# EAGLE design de0_nano_expansion_board (EAGLE 5.11)
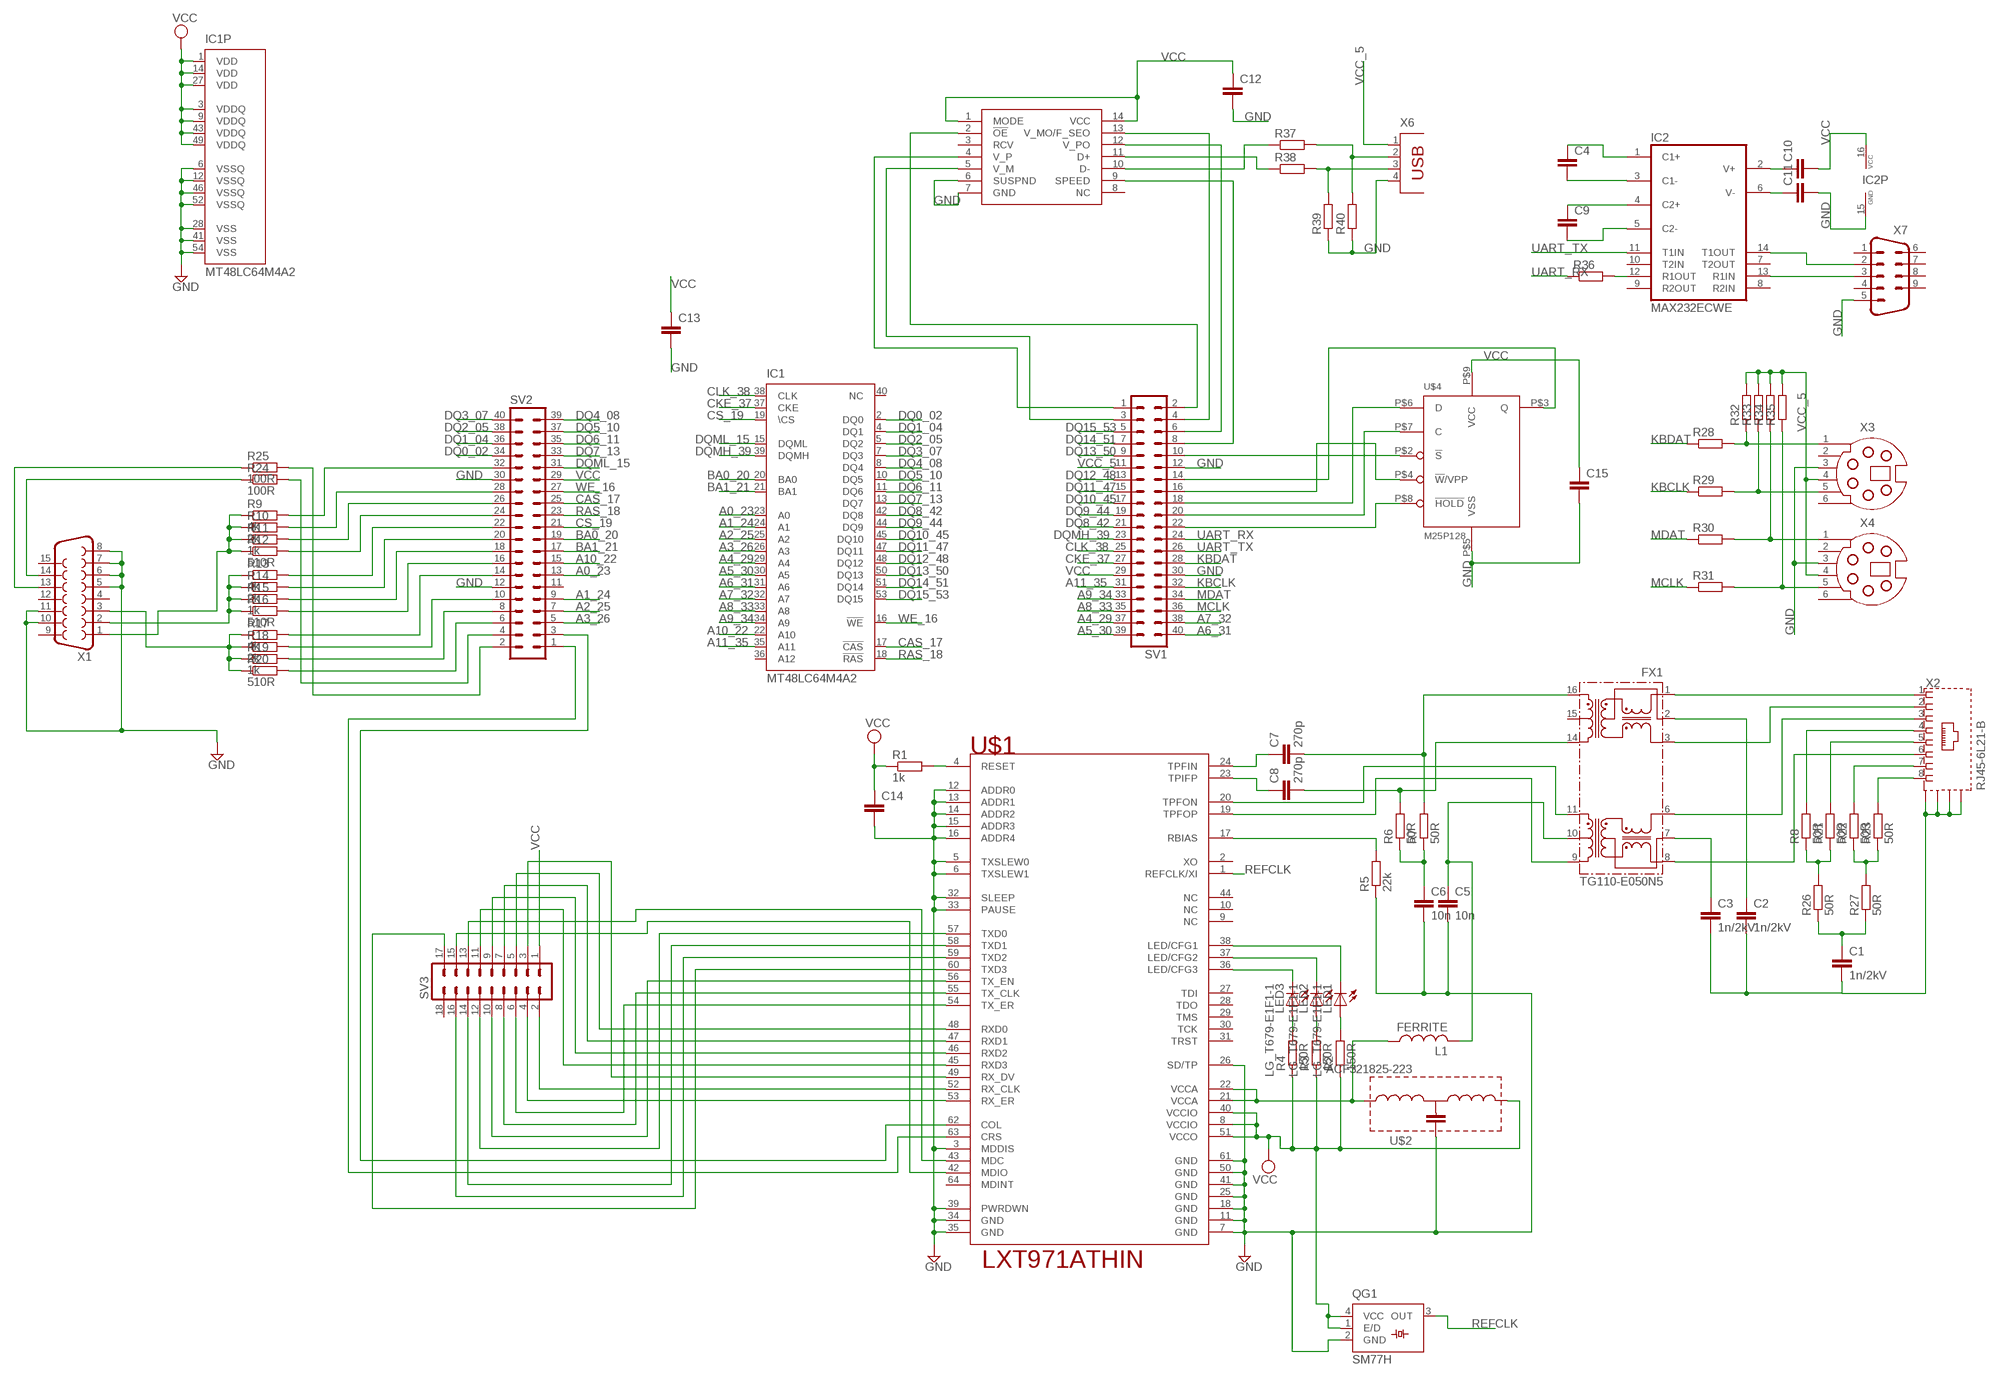
[diagram p0: schematic, sheet 1]

## Parts
C1  1n/2kV  C-EUC1812  [C1812]
C2  1n/2kV  C-EUC1812  [C1812]
C3  1n/2kV  C-EUC1812  [C1812]
C4  C-EUC0805  [C0805]
C5  10n  C-EUC0805  [C0805]
C6  10n  C-EUC0805  [C0805]
C7  270p  C-EUC0805  [C0805]
C8  270p  C-EUC0805  [C0805]
C9  C-EUC0805  [C0805]
C10  C-EUC0805  [C0805]
C11  C-EUC0805  [C0805]
C12  C-EUC0805  [C0805]
C13  C-EUC0805  [C0805]
C14  C-EUC0805  [C0805]
C15  C-EUC0805  [C0805]
FX1  TG110-E050N5  [N5]
IC1  MT48LC64M4A2  [TSOP54-400]
IC2  MAX232ECWE  [SO16L]
L1  FERRITE  L-USL4532C  [L4532M]
LED1  LG_T679-E1F1-1  [PLCC2]
LED2  LG_T679-E1F1-1  [PLCC2]
LED3  LG_T679-E1F1-1  [PLCC2]
QG1  SM77H  [SM77H]
R1  1k  R-EU_R0805  [R0805]
R2  150R  R-EU_R0805  [R0805]
R3  150R  R-EU_R0805  [R0805]
R4  150R  R-EU_R0805  [R0805]
R5  22k  R-EU_R0805  [R0805]
R6  50R  R-EU_R0805  [R0805]
R7  50R  R-EU_R0805  [R0805]
R8  50R  R-EU_R0805  [R0805]
R9  4k  R-EU_M0805  [M0805]
R10  2k  R-EU_M0805  [M0805]
R11  1k  R-EU_M0805  [M0805]
R12  510R  R-EU_M0805  [M0805]
R13  4k  R-EU_M0805  [M0805]
R14  2k  R-EU_M0805  [M0805]
R15  1k  R-EU_M0805  [M0805]
R16  510R  R-EU_M0805  [M0805]
R17  4k  R-EU_M0805  [M0805]
R18  2k  R-EU_M0805  [M0805]
R19  1k  R-EU_M0805  [M0805]
R20  510R  R-EU_M0805  [M0805]
R21  50R  R-EU_R0805  [R0805]
R22  50R  R-EU_R0805  [R0805]
R23  50R  R-EU_R0805  [R0805]
R24  100R  R-EU_M0805  [M0805]
R25  100R  R-EU_M0805  [M0805]
R26  50R  R-EU_R0805  [R0805]
R27  50R  R-EU_R0805  [R0805]
R28  R-EU_R0805  [R0805]
R29  R-EU_R0805  [R0805]
R30  R-EU_R0805  [R0805]
R31  R-EU_R0805  [R0805]
R32  R-EU_R0805  [R0805]
R33  R-EU_R0805  [R0805]
R34  R-EU_R0805  [R0805]
R35  R-EU_R0805  [R0805]
R36  R-EU_R0805  [R0805]
R37  R-EU_R0805  [R0805]
R38  R-EU_R0805  [R0805]
R39  R-EU_R0805  [R0805]
R40  R-EU_R0805  [R0805]
SV1  MA20-2  [MA20-2]
SV2  MA20-2  [MA20-2]
SV3  MA09-2  [MA09-2]
U$1  LXT971ATHIN  [LQFP64_THIN]
U$2  ACF321825-223  [FILT-223]
U$4  M25P128  [VDFPN-8]
U$5  USB1T11A  [TSSOP14]
X1  F15HDH  [HDF15H]
X2  RJ45-6L21-B  [RJ45-SHIELD1]
X3  MDSSV-BC06  [SSV-BC06]
X4  MDSSV-BC06  [SSV-BC06]
X6  PN87520  [PN87520]
X7  M09HP  [M09HP]

## Nets
A0_23 [thin]: IC1.23(A0) SV2.13
A1_24 [thin]: IC1.24(A1) SV2.9
A2_25 [thin]: IC1.25(A2) SV2.7
A3_26 [thin]: IC1.26(A3) SV2.5
A4_29 [thin]: IC1.29(A4) SV1.37
A5_30 [thin]: IC1.30(A5) SV1.39
A6_31 [thin]: IC1.31(A6) SV1.40
A7_32 [thin]: IC1.32(A7) SV1.38
A8_33 [thin]: IC1.33(A8) SV1.35
A9_34 [thin]: IC1.34(A9) SV1.33
A10_22 [thin]: IC1.22(A10) SV2.15
A11_35 [thin]: IC1.35(A11) SV1.31
BA0_20 [thin]: IC1.20(BA0) SV2.19
BA1_21 [thin]: IC1.21(BA1) SV2.17
CAS_17 [thin]: IC1.17(!CAS) SV2.25
CKE_37 [thin]: IC1.37(CKE) SV1.27
CLK_38 [thin]: IC1.38(CLK) SV1.25
CS_19 [thin]: IC1.19(\CS) SV2.21
DQ0_02 [thin]: IC1.2(DQ0) SV2.34
DQ1_04 [thin]: IC1.4(DQ1) SV2.36
DQ2_05 [thin]: IC1.5(DQ2) SV2.38
DQ3_07 [thin]: IC1.7(DQ3) SV2.40
DQ4_08 [thin]: IC1.8(DQ4) SV2.39
DQ5_10 [thin]: IC1.10(DQ5) SV2.37
DQ6_11 [thin]: IC1.11(DQ6) SV2.35
DQ7_13 [thin]: IC1.13(DQ7) SV2.33
DQ8_42 [thin]: IC1.42(DQ8) SV1.21
DQ9_44 [thin]: IC1.44(DQ9) SV1.19
DQ10_45 [thin]: IC1.45(DQ10) SV1.17
DQ11_47 [thin]: IC1.47(DQ11) SV1.15
DQ12_48 [thin]: IC1.48(DQ12) SV1.13
DQ13_50 [thin]: IC1.50(DQ13) SV1.9
DQ14_51 [thin]: IC1.51(DQ14) SV1.7
DQ15_53 [thin]: IC1.53(DQ15) SV1.5
DQMH_39 [thin]: IC1.39(DQMH) SV1.23
DQML_15 [thin]: IC1.15(DQML) SV2.31
GND [power]: C5.2 C6.2 C11.2 C12.2 C13.2 C14.2 C15.2 IC1.6(VSSQ) IC1.12(VSSQ) IC1.28(VSS) IC1.41(VSS) IC1.46(VSSQ) IC1.52(VSSQ) IC1.54(VSS) IC2.15(GND) QG1.2(GND) R5.1 R39.1 R40.1 SV1.12 SV1.30 SV2.12 SV2.30 U$1.3(MDDIS) U$1.5(TXSLEW0) U$1.6(TXSLEW1) U$1.7(GND) U$1.11(GND) U$1.12(ADDR0) U$1.13(ADDR1) U$1.14(ADDR2) U$1.15(ADDR3) U$1.16(ADDR4) U$1.18(GND) U$1.25(GND) U$1.26(SD/TP) U$1.32(SLEEP) U$1.33(PAUSE) U$1.34(GND) U$1.35(GND) U$1.39(PWRDWN) U$1.41(GND) U$1.50(GND) U$1.61(GND) U$2.P$2 U$4.P$5(VSS) U$5.6(SUSPND) U$5.7(GND) X1.5 X1.6 X1.7 X1.8 X1.10 X1.11 X3.3 X4.3 X6.4 X7.5
KBCLK: R29.1 SV1.32
KBDAT: R28.1 SV1.28
MCLK: R31.1 SV1.36
MDAT: R30.1 SV1.34
N$1: FX1.1 X2.1
N$2: C3.1 FX1.7
N$3 [thin]: R1.2 U$1.4(RESET)
N$4: LED3.A R4.2
N$5 [thin]: SV3.6 U$1.54(TX_ER)
N$6 [thin]: SV3.11 U$1.45(RXD3)
N$7: R13.1 R14.1 R15.1 R16.1 X1.2
N$8: R17.1 R18.1 R19.1 R20.1 X1.3
N$9: R9.1 R10.1 R11.1 R12.1 X1.1
N$10 [thin]: SV2.3 U$1.62(COL)
N$11 [thin]: SV2.1 U$1.63(CRS)
N$12 [thin]: SV3.8 U$1.55(TX_CLK)
N$13 [thin]: SV3.10 U$1.56(TX_EN)
N$14 [thin]: SV3.9 U$1.46(RXD2)
N$15 [thin]: FX1.9 U$1.19(TPFOP)
N$16: R25.1 X1.13
N$17 [thin]: SV3.7 U$1.47(RXD1)
N$18: R24.1 X1.14
N$19: R20.2 SV2.6
N$20: L1.1 U$1.21(VCCA) U$1.22(VCCA) U$2.P$1
N$21 [thin]: LED3.C U$1.36(LED/CFG3)
N$22 [thin]: LED2.C U$1.37(LED/CFG2)
N$23 [thin]: LED1.C U$1.38(LED/CFG1)
N$24 [thin]: SV3.5 U$1.48(RXD0)
N$25: LED2.A R3.2
N$26: LED1.A R2.2
N$27: C2.1 FX1.2
N$28: FX1.3 X2.2
N$29: FX1.6 X2.3
N$30: C5.1 FX1.10 L1.2
N$31 [thin]: C7.1 U$1.24(TPFIN)
N$32 [thin]: C8.1 U$1.23(TPIFP)
N$33 [thin]: R5.2 U$1.17(RBIAS)
N$34: C7.2 FX1.16 R7.2
N$35: C8.2 FX1.14 R6.2
N$36: C6.1 R6.1 R7.1
N$37 [thin]: FX1.11 U$1.20(TPFON)
N$38: FX1.8 X2.6
N$39: R19.2 SV2.8
N$40: R18.2 SV2.10
N$41: R17.2 SV2.14
N$42: R16.2 SV2.16
N$43: R15.2 SV2.18
N$44: R14.2 SV2.20
N$45: R13.2 SV2.22
N$46: R12.2 SV2.24
N$47: R11.2 SV2.26
N$48: R10.2 SV2.28
N$49: R9.2 SV2.32
N$50: R24.2 SV2.4
N$51: R25.2 SV2.2
N$52 [thin]: SV3.3 U$1.49(RX_DV)
N$53 [thin]: SV3.2 U$1.52(RX_CLK)
N$54 [thin]: SV3.4 U$1.53(RX_ER)
N$55 [thin]: SV3.13 U$1.43(MDC)
N$56 [thin]: SV3.15 U$1.42(MDIO)
N$57 [thin]: SV3.12 U$1.57(TXD0)
N$58 [thin]: SV3.14 U$1.58(TXD1)
N$59 [thin]: SV3.16 U$1.59(TXD2)
N$60 [thin]: SV3.17 U$1.60(TXD3)
N$61: R8.2 X2.4
N$62: R21.2 X2.5
N$63: R22.2 X2.7
N$64: R23.2 X2.8
N$65: R8.1 R21.1 R26.2
N$66: R28.2 R32.1 X3.1
N$67: R22.1 R23.1 R27.2
N$68: R29.2 R33.1 X3.5
N$69: C1.1 R26.1 R27.1
N$70: C1.2 C2.2 C3.2 X2.S1(S) X2.S2(S) X2.S3(S) X2.S4(S)
N$71: R30.2 R34.1 X4.1
N$72: R31.2 R35.1 X4.5
N$73: IC2.12(R1OUT) R36.2
N$74: C4.1 IC2.1(C1+)
N$75: C4.2 IC2.3(C1-)
N$76: C9.1 IC2.4(C2+)
N$77: C9.2 IC2.5(C2-)
N$78: C10.1 IC2.2(V+)
N$79: C11.1 IC2.6(V-)
N$80: IC2.14(T1OUT) X7.2
N$81: IC2.13(R1IN) X7.3
N$82: SV1.22 U$4.P$8(!HOLD)
N$83: SV1.20 U$4.P$7(C)
N$84: SV1.18 U$4.P$6(D)
N$85: SV1.10 U$4.P$2(!S)
N$86: SV1.16 U$4.P$4(!W!/VPP)
N$87: SV1.14 U$4.P$3(Q)
N$88: R37.2 R40.2 X6.2
N$89: R38.2 R39.2 X6.3
N$90 [thin]: R37.1 U$5.10(D-)
N$91 [thin]: R38.1 U$5.11(D+)
N$92 [thin]: SV1.1 U$5.4(V_P)
N$93 [thin]: SV1.3 U$5.5(V_M)
N$94 [thin]: SV1.2 U$5.2(!OE)
N$95 [thin]: SV1.4 U$5.13(V_MO/F_SEO)
N$96 [thin]: SV1.6 U$5.12(V_PO)
N$97 [thin]: SV1.8 U$5.9(SPEED)
RAS_18 [thin]: IC1.18(!RAS) SV2.23
REFCLK [thin]: QG1.3(OUT) U$1.1(REFCLK/XI)
UART_RX: R36.1 SV1.24
UART_TX: IC2.11(T1IN) SV1.26
VCC [thin]: C10.2 C12.1 C13.1 C14.1 C15.1 IC1.1(VDD) IC1.3(VDDQ) IC1.9(VDDQ) IC1.14(VDD) IC1.27(VDD) IC1.43(VDDQ) IC1.49(VDDQ) IC2.16(VCC) QG1.1(E/D) QG1.4(VCC) R1.1 R2.1 R3.1 R4.1 SV1.29 SV2.29 SV3.1 U$1.8(VCCIO) U$1.40(VCCIO) U$1.51(VCCO) U$2.P$3 U$4.P$9(VCC) U$5.1(MODE) U$5.14(VCC)
VCC_5: R32.2 R33.2 R34.2 R35.2 SV1.11 X3.4 X4.4 X6.1
WE_16 [thin]: IC1.16(!WE) SV2.27
Unconnected: FX1.15 IC1.36(A12) IC1.40(NC) IC2.7(T2OUT) IC2.8(R2IN) IC2.9(R2OUT) IC2.10(T2IN) SV2.11 SV3.18 U$1.2(XO) U$1.9(NC) U$1.10(NC) U$1.27(TDI) U$1.28(TDO) U$1.29(TMS) U$1.30(TCK) U$1.31(TRST) U$1.44(NC) U$1.64(MDINT) U$5.3(RCV) U$5.8(NC) X1.4 X1.9 X1.12 X1.15 X3.2 X3.6 X4.2 X4.6 X7.1 X7.4 X7.6 X7.7 X7.8 X7.9

## Library data of the parts
C1-C15 = rcl:C-EU: CAPACITOR, European symbol
FX1 = halo-electronics:TG110-E050N5: E-Ultra (TM) 10/100BASE-TX SOIC-16 Fast Ethernet Magnetic Modules Source: www.haloelectronics.com .. e-ultra.pdf
IC1 = memory-micron:MT48LC64M4A2: 256Mb: x16 SDRAM MT48LC64M4A2 - 16 Meg x 4 x 4 banks Source: http://download.micron.com/pdf/datasheets/dram/sdram/256MSDRAM.pdf; OC_FARNELL: unknown; OC_NEWARK: unknown
IC2 = maxim:MAX232ECWE: RS232 TRANSEIVER; MF: MAXIM; MPN: MAX232ECWE+; OC_FARNELL: 9724435; OC_NEWARK: 67K4440
L1 = rcl:L-US: INDUCTOR, American symbol
LED1-LED3 = led:*_T679-?-1: LC TOPLED® Low Current LED Source: http://catalog.osram-os.com .. LG_LS_LY_T679_OBS.pdf; COLOR: green
QG1 = crystal:SM77H: 3.3V CMOS Clock Oscillator Source: www.pletronics.com .. sm77h%203.3v.pdf; OC_FARNELL: unknown; OC_NEWARK: unknown
R1-R40 = rcl:R-EU_: RESISTOR, European symbol
SV1 SV2 = con-lstb:MA20-2: PIN HEADER; OC_FARNELL: unknown; OC_NEWARK: unknown
SV3 = con-lstb:MA09-2: PIN HEADER; OC_FARNELL: unknown; OC_NEWARK: unknown
U$1 = my_parts:LXT971A
U$2 = my_parts:ACF321825-223
U$4 = m25p128:M25P128: M25P128 128-Mbit, low-voltage, serial flash memory with 54-MHz SPI bus interface
U$5 = my_parts:USB1T11A
X1 = con-subd:F15: SUB-D; OC_FARNELL: unknown; OC_NEWARK: unknown
X2 = con-tycoelectronics:RJ45*2: RJ45 Low Profile Shield Type 2 For all RJ45 L, LC, LCT and X Series Models Source: www.tycoelectronics.com .. ENG_DS_1654001_1099_RJ_L_0507.pdf; OC_FARNELL: unknown; OC_NEWARK: unknown
X3 X4 = con-yamaichi:MDSSV-BC06: YAMAICHI CONNECTOR; OC_FARNELL: unknown; OC_NEWARK: unknown
X6 = con-berg:PN87520: BERG USB connector; OC_FARNELL: unknown; OC_NEWARK: unknown
X7 = con-subd:M09: SUB-D; OC_FARNELL: unknown; OC_NEWARK: unknown

## Net classes
0 default: width 0.45 mm, drill 0.381 mm, clearance 1.016 mm
1 power: width 0.889 mm, drill 0.61 mm, clearance 0.762 mm
2 thin: width 0.2 mm, drill 0.61 mm, clearance 0.508 mm

## Board
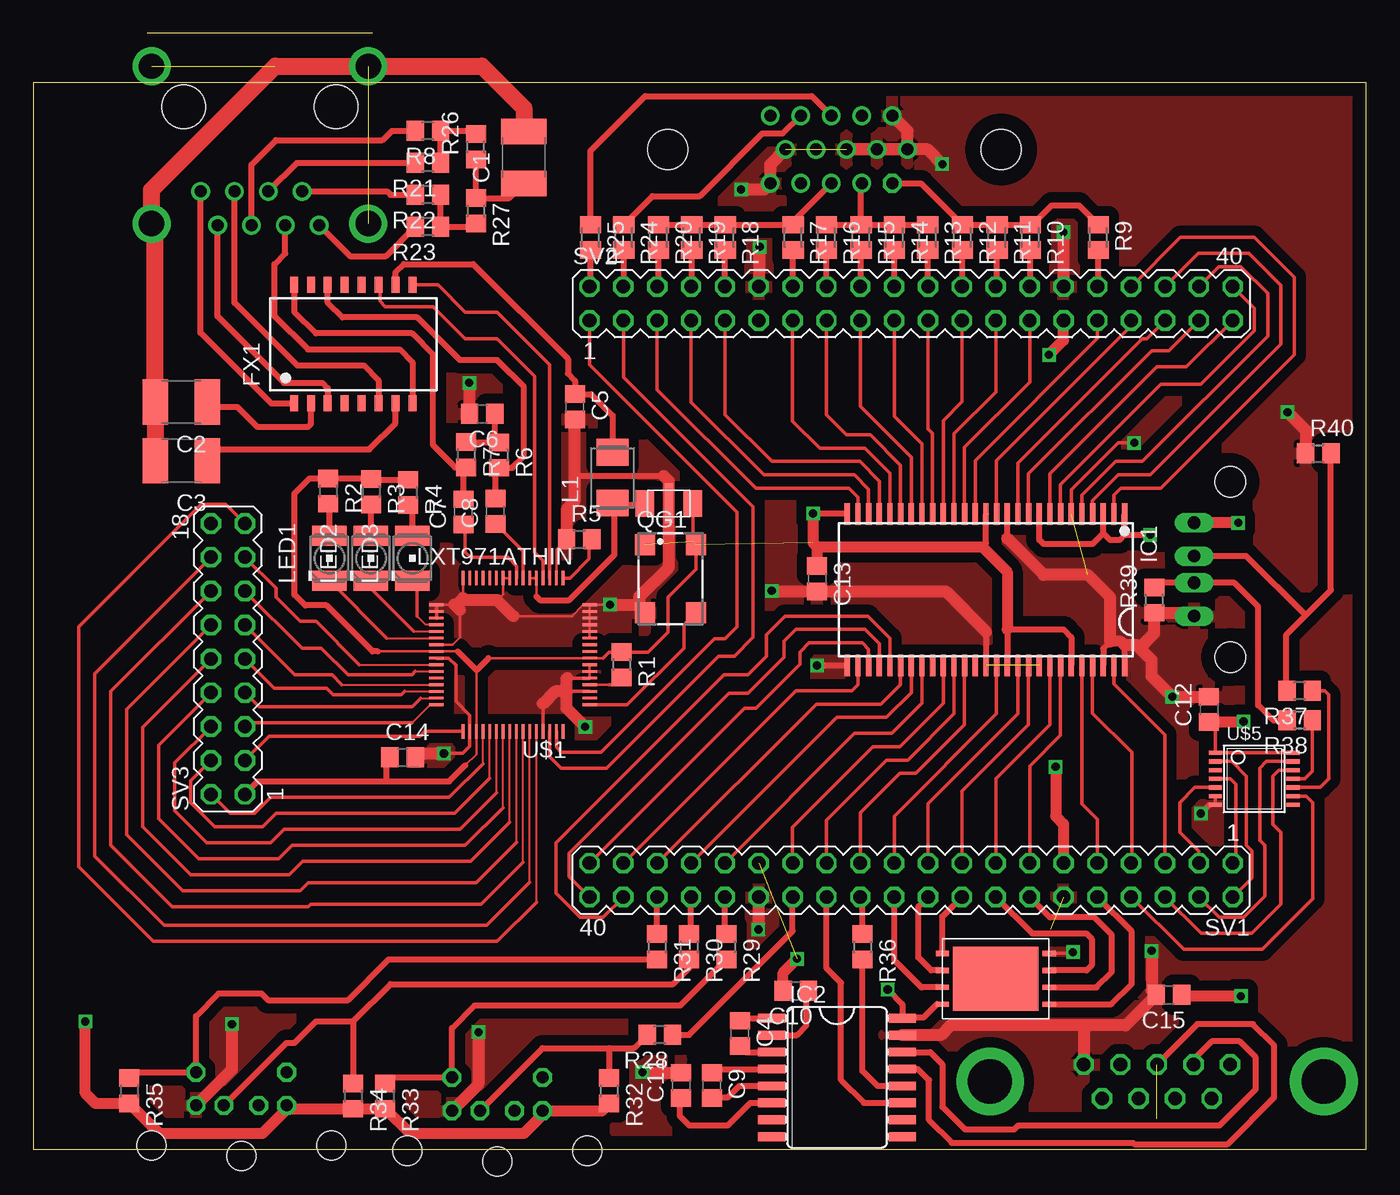
[diagram p1: board, top side]
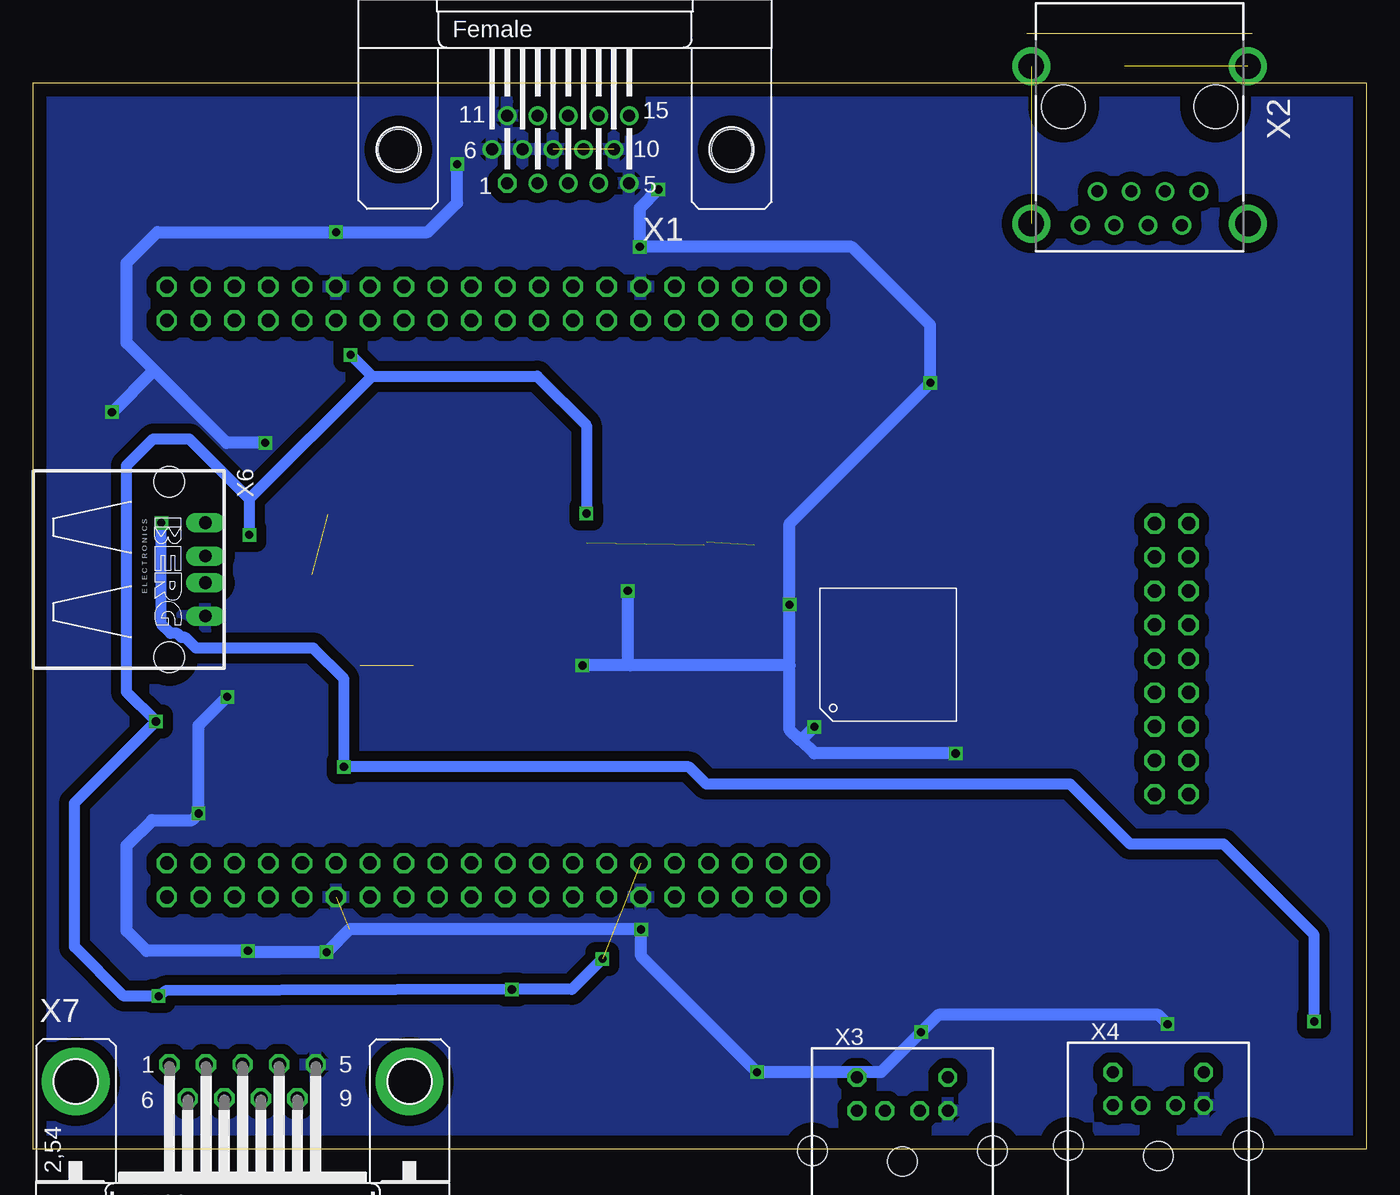
[diagram p2: board, bottom side, seen from below]

Size 100 x 80 mm. Coordinates in mm from the lower left corner, seen from the top.
Outline: 0,0 100,0 100,80 0,80 0,0
Copper layers (1*16): Top 0.035mm / dielectric 1.5mm / Bottom 0.035mm
Design rules "default": minimum track width 10mil, minimum drill 24mil, track to track 8mil, track to pad 8mil, pad to pad 8mil, via to via 8mil, smd to smd 8mil, copper to edge 40mil, drill to drill 8mil, minimum pad ring 10mil, minimum via ring 8mil, stop-mask expansion 4mil, vias tented up to drill 0mil, thermal gap 10mil

### Footprints (pad centres in the part's own frame; a part is rotated, then mirrored left to right if it is on the bottom)
C1812 = smd 1.9 x 3.4: 1 -1.95,0; 2 1.95,0
C0805 = smd 1.3 x 1.5: 1 -0.95,0; 2 0.95,0
N5 = smd 0.6 x 1.2: 1 -4.445,-4.445; 2 -3.175,-4.445; 3 -1.905,-4.445; 4 -0.635,-4.445; 5 0.635,-4.445; 6 1.905,-4.445; 7 3.175,-4.445; 8 4.445,-4.445; 9 4.445,4.445; 10 3.175,4.445; 11 1.905,4.445; 12 0.635,4.445; 13 -0.635,4.445; 14 -1.905,4.445; 15 -3.175,4.445; 16 -4.445,4.445
TSOP54-400 = smd 0.4 x 1.6: 1 -10.4,-5.68; 2 -9.6,-5.68; 3 -8.8,-5.68; 4 -8,-5.68; 5 -7.2,-5.68; 6 -6.4,-5.68; 7 -5.6,-5.68; 8 -4.8,-5.68; 9 -4,-5.68; 10 -3.2,-5.68; 11 -2.4,-5.68; 12 -1.6,-5.68; 13 -0.8,-5.68; 14 0,-5.68; 15 0.8,-5.68; 16 1.6,-5.68; 17 2.4,-5.68; 18 3.2,-5.68; 19 4,-5.68; 20 4.8,-5.68; 21 5.6,-5.68; 22 6.4,-5.68; 23 7.2,-5.68; 24 8,-5.68; 25 8.8,-5.68; 26 9.6,-5.68; 27 10.4,-5.68; 28 10.4,5.68; 29 9.6,5.68; 30 8.8,5.68; 31 8,5.68; 32 7.2,5.68; 33 6.4,5.68; 34 5.6,5.68; 35 4.8,5.68; 36 4,5.68; 37 3.2,5.68; 38 2.4,5.68; 39 1.6,5.68; 40 0.8,5.68; 41 0,5.68; 42 -0.8,5.68; 43 -1.6,5.68; 44 -2.4,5.68; 45 -3.2,5.68; 46 -4,5.68; 47 -4.8,5.68; 48 -5.6,5.68; 49 -6.4,5.68; 50 -7.2,5.68; 51 -8,5.68; 52 -8.8,5.68; 53 -9.6,5.68; 54 -10.4,5.68
SO16L = smd 0.66 x 2.032: 1 -4.445,-4.902; 2 -3.175,-4.902; 3 -1.905,-4.902; 4 -0.635,-4.902; 5 0.635,-4.902; 6 1.905,-4.902; 7 3.175,-4.902; 8 4.445,-4.902; 9 4.445,4.902; 10 3.175,4.902; 11 1.905,4.902; 12 0.635,4.902; 13 -0.635,4.902; 14 -1.905,4.902; 15 -3.175,4.902; 16 -4.445,4.902
L4532M = smd 2 x 2.4: 1 -1.9,0; 2 1.9,0
PLCC2 = smd 2.6 x 1.5: A 0,1.7; C 0,-1.7
SM77H = smd 1.6 x 1.5: 1 -2.55,-1.9; 2 2.55,-1.9; 3 2.55,1.9; 4 -2.55,1.9
R0805 = smd 1.3 x 1.5: 1 -0.95,0; 2 0.95,0
M0805 = smd 1.3 x 1.6: 1 -0.95,0; 2 0.95,0
MA20-2 = drill 1.016 octagon: 1 -24.13,-1.27; 2 -24.13,1.27; 3 -21.59,-1.27; 4 -21.59,1.27; 5 -19.05,-1.27; 6 -19.05,1.27; 7 -16.51,-1.27; 8 -16.51,1.27; 9 -13.97,-1.27; 10 -13.97,1.27; 11 -11.43,-1.27; 12 -11.43,1.27; 13 -8.89,-1.27; 14 -8.89,1.27; 15 -6.35,-1.27; 16 -6.35,1.27; 17 -3.81,-1.27; 18 -3.81,1.27; 19 -1.27,-1.27; 20 -1.27,1.27; 21 1.27,-1.27; 22 1.27,1.27; 23 3.81,-1.27; 24 3.81,1.27; 25 6.35,-1.27; 26 6.35,1.27; 27 8.89,-1.27; 28 8.89,1.27; 29 11.43,-1.27; 30 11.43,1.27; 31 13.97,-1.27; 32 13.97,1.27; 33 16.51,-1.27; 34 16.51,1.27; 35 19.05,-1.27; 36 19.05,1.27; 37 21.59,-1.27; 38 21.59,1.27; 39 24.13,-1.27; 40 24.13,1.27
MA09-2 = drill 1.016 octagon: 1 -10.16,-1.27; 2 -10.16,1.27; 3 -7.62,-1.27; 4 -7.62,1.27; 5 -5.08,-1.27; 6 -5.08,1.27; 7 -2.54,-1.27; 8 -2.54,1.27; 9 0,-1.27; 10 0,1.27; 11 2.54,-1.27; 12 2.54,1.27; 13 5.08,-1.27; 14 5.08,1.27; 15 7.62,-1.27; 16 7.62,1.27; 17 10.16,-1.27; 18 10.16,1.27
LQFP64_THIN = smd 1.1 x 0.2: 1 -5.75,3.75; 2 -5.75,3.25; 3 -5.75,2.75; 4 -5.75,2.25; 5 -5.75,1.75; 6 -5.75,1.25; 7 -5.75,0.75; 8 -5.75,0.25; 9 -5.75,-0.25; 10 -5.75,-0.75; 11 -5.75,-1.25; 12 -5.75,-1.75; 13 -5.75,-2.25; 14 -5.75,-2.75; 15 -5.75,-3.25; 16 -5.75,-3.75; 33 5.75,-3.75; 34 5.75,-3.25; 35 5.75,-2.75; 36 5.75,-2.25; 37 5.75,-1.75; 38 5.75,-1.25; 39 5.75,-0.75; 40 5.75,-0.25; 41 5.75,0.25; 42 5.75,0.75; 43 5.75,1.25; 44 5.75,1.75; 45 5.75,2.25; 46 5.75,2.75; 47 5.75,3.25; 48 5.75,3.75 | smd 0.2 x 1.1: 17 -3.75,-5.75; 18 -3.25,-5.75; 19 -2.75,-5.75; 20 -2.25,-5.75; 21 -1.75,-5.75; 22 -1.25,-5.75; 23 -0.75,-5.75; 24 -0.25,-5.75; 25 0.25,-5.75; 26 0.75,-5.75; 27 1.25,-5.75; 28 1.75,-5.75; 29 2.25,-5.75; 30 2.75,-5.75; 31 3.25,-5.75; 32 3.75,-5.75; 49 3.75,5.75; 50 3.25,5.75; 51 2.75,5.75; 52 2.25,5.75; 53 1.75,5.75; 54 1.25,5.75; 55 0.75,5.75; 56 0.25,5.75; 57 -0.25,5.75; 58 -0.75,5.75; 59 -1.25,5.75; 60 -1.75,5.75; 61 -2.25,5.75; 62 -2.75,5.75; 63 -3.25,5.75; 64 -3.75,5.75
FILT-223 = smd 1.4 x 2: P$1 -1.8,0; P$3 1.8,0 | smd 0.6 x 3: P$2 0,0
VDFPN-8 = smd 6.4 x 4.8: P$1 0,0 | smd 1 x 0.4: P$2 -4,1.905; P$3 -4,0.635; P$4 -4,-0.635; P$5 -4,-1.905; P$6 4,-1.905; P$7 4,-0.635; P$8 4,0.635; P$9 4,1.905
TSSOP14 = smd 0.305 x 0.991: 1 -1.95,-2.918; 2 -1.3,-2.918; 3 -0.65,-2.918; 4 0,-2.918; 5 0.65,-2.918; 6 1.3,-2.918; 7 1.95,-2.918; 8 1.95,2.918; 9 1.3,2.918; 10 0.65,2.918; 11 0,2.918; 12 -0.65,2.918; 13 -1.3,2.918; 14 -1.95,2.918
HDF15H = drill 0.9 octagon: 1 4.329,2.54 | drill 0.9 round: 2 2.043,2.54; 3 -0.243,2.54; 4 -2.529,2.54; 5 -4.815,2.54; 6 5.472,0; 7 3.186,0; 8 0.9,0; 9 -1.386,0; 10 -3.672,0; 11 4.329,-2.54; 12 2.043,-2.54; 13 -0.243,-2.54; 14 -2.529,-2.54; 15 -4.815,-2.54 | hole 3: -12.5,0; 12.5,0
RJ45-SHIELD1 = drill 0.9 pad 1.4 round: 1 -4.445,6.35; 2 -3.175,8.89; 3 -1.905,6.35; 4 -0.635,8.89; 5 0.635,6.35; 6 1.905,8.89; 7 3.175,6.35; 8 4.445,8.89 | drill 1.9 pad 2.5 round: S1 -8.128,-3.048; S2 8.128,-3.048; S3 -8.128,8.76; S4 8.128,8.76 | hole 3.251: -5.715,0; 5.715,0
SSV-BC06 = drill 0.9 octagon: 1 1.3,8.5; 2 -1.3,8.5; 3 3.4,8.5; 4 -3.4,8.5; 5 3.4,11; 6 -3.4,11 | hole 2.2: -6.75,5.5; 0,4.7; 6.75,5.5
PN87520 = drill 0.95 long: 1 -3.5,2.71; 2 -1,2.71; 3 1,2.71; 4 3.5,2.71 | hole 2.3: -6.57,0; 6.57,0
M09HP = drill 1.016 octagon: 1 -5.486,1.27; 2 -2.743,1.27; 3 0,1.27; 4 2.743,1.27; 5 5.486,1.27; 6 -4.115,-1.27; 7 -1.372,-1.27; 8 1.372,-1.27; 9 4.115,-1.27 | drill 3.302 pad 5.08 round: G1 -12.522,0; G2 12.522,0

### Placement (x,y rotation side)
C1  36.8,74.4 90 top
C2  11.1,56.06 180 top
C3  11.12,51.66 180 top
C4  53,8.7 270 top
C5  40.63,55.7 270 top
C6  33.68,55.17 180 top
C7  32.27,47.82 90 top
C8  34.67,47.87 90 top
C9  50.9,4.8 270 top
C10  57.2,11.9 180 top
C11  48.6,4.8 90 top
C12  88.2,33 90 top
C13  58.8,42.8 270 top
C14  27.7,29.4 0 top
C15  85.2,11.6 180 top
FX1  24,60.4 0 top
IC1  71.47,41.98 180 top
IC2  60.3,5.4 270 top
L1  43.46,50.39 90 top
LED1  22.22,44.34 0 top
LED2  25.33,44.34 0 top
LED3  28.44,44.34 0 top
QG1  47.8,42.8 270 top
R1  44.13,36.36 270 top
R2  22.13,49.38 270 top
R3  25.33,49.33 270 top
R4  28.13,49.28 270 top
R5  40.96,45.78 0 top
R6  34.93,52.08 270 top
R7  32.48,52.11 270 top
R8  29.6,76.4 180 top
R9  79.9,68.4 270 top
R10  74.8,68.4 270 top
R11  72.3,68.4 270 top
R12  69.7,68.4 270 top
R13  67.1,68.4 270 top
R14  64.6,68.4 270 top
R15  62.1,68.4 270 top
R16  59.5,68.4 270 top
R17  57,68.4 270 top
R18  51.9,68.4 270 top
R19  49.4,68.4 270 top
R20  46.9,68.4 270 top
R21  29.6,74 180 top
R22  29.6,71.6 180 top
R23  29.6,69.2 180 top
R24  44.3,68.4 270 top
R25  41.8,68.4 270 top
R26  33.2,75.2 90 top
R27  33.2,70.4 270 top
R28  47,8.6 180 top
R29  52,15.2 270 top
R30  49.2,15.2 270 top
R31  46.8,15.2 270 top
R32  43.2,4.4 270 top
R33  26.4,4 270 top
R34  24,4 270 top
R35  7.2,4.4 270 top
R36  62.2,15.2 270 top
R37  95,34.4 180 top
R38  95,32.2 180 top
R39  84.1,41.2 90 top
R40  96.4,52.2 0 top
SV1  65.86,20.2 180 top
SV2  65.86,63.44 0 top
SV3  14.6,36.8 90 top
U$1  35.99,37.11 180 top
U$2  47.68,48.46 0 top
U$4  72.2,12.8 180 top
U$5  91.6,27.8 270 top
X1  60.11,75 180 bottom
X2  17,78.2 180 bottom
X3  34.8,-5.6 0 bottom
X4  15.6,-5.2 0 bottom
X6  89.8,43.5 270 bottom
X7  84.3,5.1 0 bottom

### Tracks (layer width: path | path; a pad name or v marks a point on that pad's centre or on a via)
A0_23
  Top 0.254: IC1.23 64.27,50.73 62.4,52.6 59,52.6 56.97,54.63 SV2.13
A1_24
  Top 0.254: IC1.24 63.47,50.13 62,51.6 55.4,51.6 51.89,55.11 SV2.9
A2_25
  Top 0.254: IC1.25 62.67,49.53 61.6,50.6 54.8,50.6 49.35,56.05 SV2.7
A3_26
  Top 0.254: IC1.26 61.87,48.93 61.2,49.6 54.2,49.6 46.81,56.99 SV2.5
  Top 0.45: SV2.5 46.83,62.17
A4_29
  Top 0.254: IC1.29 61.87,34.87 61.4,34.4 57.2,34.4 SV1.37
A5_30
  Top 0.254: IC1.30 62.67,37.53 62.2,38 58.2,38 57.5,37.3 57.5,36.4 54.2,33.1 53.36,33.1 SV1.39
A6_31
  Top 0.254: SV1.40 40.2,20.46 40.2,22.2 52.2,34.2 53.6,34.2 56.3,36.9 56.3,38.1 57.2,39 62.4,39 63.47,37.93 IC1.31
A7_32
  Top 0.254: SV1.38 42.74,17.4 41,17.4 39.2,19.2 39.2,23 51.8,35.6 53.6,35.6 55,37 55,38.6 56.4,40 62.6,40 64.27,38.33 IC1.32
A8_33
  Top 0.254: IC1.33 65.07,34.87 63.6,33.4 58.74,33.4 SV1.35
A9_34
  Top 0.254: IC1.34 65.87,34.27 64,32.4 60.28,32.4 SV1.33
A10_22
  Top 0.254: IC1.22 65.07,51.33 62.8,53.6 61,53.6 59.51,55.09 SV2.15
A11_35
  Top 0.254: IC1.35 66.67,33.47 64.4,31.2 61.62,31.2 SV1.31
BA0_20
  Top 0.254: IC1.20 66.67,52.93 64.59,55.01 SV2.19
BA1_21
  Top 0.254: IC1.21 65.87,51.93 62.05,55.75 SV2.17
CAS_17
  Top 0.254: IC1.17 69.07,53.67 72.21,56.81 SV2.25
CKE_37
  Top 0.254: IC1.37 68.27,33.47 65,30.2 63,30.2 56.97,24.17 SV1.27
CLK_38
  Top 0.254: IC1.38 69.07,32.67 65.6,29.2 64,29.2 59.51,24.71 SV1.25
CS_19
  Top 0.254: IC1.19 67.47,53.73 67.13,54.07 SV2.21
DQ0_02
  Top 0.254: SV2.34 86.06,68.4 91.6,68.4 94.6,65.4 94.6,59.6 84.6,49.6 81.6,49.6 81.07,49.07 IC1.2
DQ1_04
  Top 0.254: SV2.36 87.4,67.2 91.2,67.2 93.6,64.8 93.6,60.4 83.8,50.6 81.4,50.6 79.47,48.67 IC1.4
DQ2_05
  Top 0.254: SV2.38 88.94,66.2 90.6,66.2 92.6,64.2 92.6,61 83.2,51.6 81.2,51.6 78.67,49.07 IC1.5
DQ3_07
  Top 0.254: SV2.40 91.6,63.1 91.6,61.4 87.6,57.4 84.6,57.4 77.07,49.87 IC1.7
DQ4_08
  Top 0.254: IC1.8 76.27,50.67 84.3,58.7 86.52,58.7 SV2.39
DQ5_10
  Top 0.254: IC1.10 74.67,50.67 83.9,59.9 85.18,59.9 SV2.37
DQ6_11
  Top 0.254: IC1.11 73.87,51.47 83.2,60.8 83.54,60.8 SV2.35
DQ7_13
  Top 0.254: IC1.13 72.27,51.67 82.37,61.77 SV2.33
DQ8_42
  Top 0.254: IC1.42 72.27,32.67 64.59,24.99 SV1.21
DQ9_44
  Top 0.254: IC1.44 73.87,32.67 67.13,25.93 SV1.19
DQ10_45
  Top 0.254: IC1.45 74.67,31.87 69.67,26.87 SV1.17
DQ11_47
  Top 0.254: IC1.47 76.27,31.87 72.21,27.81 SV1.15
DQ12_48
  Top 0.254: IC1.48 77.07,31.07 74.75,28.75 SV1.13
DQ13_50
  Top 0.254: IC1.50 78.67,25.93 79.83,24.77 SV1.9
DQ14_51
  Top 0.254: IC1.51 79.47,32.73 82.4,29.8 82.4,21.5 SV1.7
DQ15_53
  Top 0.254: IC1.53 81.07,34.93 84.91,31.09 SV1.5
DQMH_39
  Top 0.254: IC1.39 69.87,31.87 66.2,28.2 65,28.2 62.05,25.25 SV1.23
DQML_15
  Top 0.254: IC1.15 70.67,51.67 79.83,60.83 SV2.31
GND  (via drill 0.61)  (4 unrouted)
  Top 0.2: U$1.16 U$1.15 U$1.14 U$1.13 U$1.12 U$1.11 | v43.26,40.86 U$1.16 | 32.24,41.36 U$1.32 | U$1.16 41.26,40.86 40.4,40 36,40 | 31.6,40.86 U$1.33 | U$1.39 31.46,37.86 32,38.4 32,40.46 | 34.8,41.2 35.24,41.64 U$1.26 U$1.25 | U$1.7 U$1.6 U$1.5 | U$1.18 39.24,45.01 R5.1
  Top 0.25: U$5.6 U$5.7 88.25,25.85
  Top 0.254: U$1.35 U$1.34 U$1.33 | U$4.P$5 77.91,14.71 v78,14.8 | U$1.41 31.14,36.86 31.7,36.3 31.7,33.6 32.74,32.56 U$1.50 32.74,30.24 32.2,29.7 v30.8,29.7 | 38.24,33.44 U$1.61 | 40,34.36 U$1.3 | 40.06,35.36 U$1.5 | IC1.6 77.87,49.47 81.4,53 v82.6,53
  Top 0.45: v87.6,25.2 88.25,25.85 | 71.47,38.83 IC1.41 | 73.07,45.83 IC1.12 | 81.87,37.83 IC1.54 | 80.8,38.1 80.27,37.57 IC1.52 | v58.8,36.3 IC1.28 | 47.3,50.5 40.7,50.5
  Top 0.813: 81.87,37.83 81.6,38.1 80.8,38.1
  Top 0.889: 36,40 34.8,41.2 32.4,41.2 32.24,41.36 31.74,40.86 31.6,40.86 32,40.46 | IC2.15 68.08,8.57 68.8,9.3 79.1,9.3 | R40.1 95.45,53.95 v94.1,55.3 | v77.29,68.8 SV2.30 | v54.5,67.7 54.43,67.63 SV2.12 | 38.24,33.44 39.16,34.36 40,34.36 | 40.06,35.36 40,35.3 40,34.36 | v41.4,31.7 40,33.1 40,34.36 | C6.2 32.7,55.2 v32.7,57.5 | 71.47,38.83 68.45,41.85 C13.2 55.45,41.85 v55.4,41.9 | C14.2 28.95,29.7 v30.8,29.7 | 73.07,45.83 75.8,43.1 79.1,43.1 80.8,41.4 80.8,38.1 | C12.2 v85.45,33.95 83.9,35.5 83.9,36.7 83,37.6 | 83,37.6 82.77,37.83 81.87,37.83 | X4.3 14.9,6 v14.9,9.4 | X3.3 33.4,4.9 v33.4,8.8 | SV1.30 54.43,16.53 v54.4,16.5 | C11.2 45.75,5.75 v45.7,5.8 | C5.2 40.6,54.72 40.6,50.4 | 40.6,50.4 40.6,48.6 40.01,48.01 R5.1 | 47.3,50.5 47.68,50.12 U$2.P$2 47.68,43.68 45.48,41.48 45.48,40.67 | 40.7,50.5 40.6,50.4 | v43.26,40.86 45.29,40.86 45.48,40.67 | 45.48,40.67 QG1.2 | X1.11 65.58,76.4 X1.6 | X1.6 X1.7 X1.8 | X1.10 55.3,73.86 X1.5 54.84,72 v53.1,72 | X1.6 67.1,75 v68.2,73.9 | 83,37.6 84.1,38.7 R39.1 86.84,40.25 X6.4 | v83.9,14.9 83.9,11.95 C15.2 81.95,9.3 79.1,9.3 | X7.5 78.81,9.01 79.1,9.3
  Bottom 0.889: 42.4,30.7 v41.4,31.7 | 42.4,30.7 42.5,30.7 43.26,31.46 43.26,36.3 | v30.8,29.7 41.4,29.7 42.4,30.7 | 43.26,36.3 v43.26,40.86 43.26,46.94 v32.7,57.5 32.7,61.8 38.6,67.7 v54.5,67.7 54.5,70.6 v53.1,72 | v82.6,53 85.5,53 91,58.5 | 91,58.5 93,60.5 93,66.5 90.7,68.8 v77.29,68.8 70.4,68.8 68.2,71 v68.2,73.9 | v94.1,55.3 91,58.4 91,58.5 | v85.45,33.95 87.6,31.8 v87.6,25.2 88.1,24.7 91.1,24.7 93,22.8 93,16.4 91.5,14.9 v83.9,14.9 83.8,14.8 v78,14.8 76.3,16.5 v54.4,16.5 54.4,14.5 v45.7,5.8 36.4,5.8 v33.4,8.8 32.1,10.1 15.6,10.1 v14.9,9.4 | 43.26,36.3 55.2,36.3 | 55.2,36.3 v58.8,36.3 | v55.4,41.9 55.4,36.5 55.2,36.3
  pour Top: 0,80 100,80 100,0 0,0
  pour Bottom: 0,80 100,80 100,0 0,0
KBCLK
  Top 0.45: SV1.32 51.89,16.26 R29.1
KBDAT
  Top 0.45: 56.93,18.93 SV1.28 56.97,16.37 49.2,8.6 R28.1
MCLK
  Top 0.45: SV1.36 R31.1
MDAT
  Top 0.45: SV1.34 49.35,16.3 R30.1
N$1
  Top 0.45: FX1.1 17.84,55.95 12.55,61.24 X2.1
N$2
  Top 0.45: FX1.7 27.18,54.48 25.2,52.5 13.91,52.5 C3.1
N$3
  Top 0.2: U$1.4 43.18,34.86
  Top 0.254: 43.18,34.86 43.58,34.86 R1.2
N$4
  Top 0.45: LED3.A 28.44,48.02 R4.2
N$5
  Top 0.15: 34.74,26.74 U$1.54
  Top 0.254: 34.74,26.74 32,24 18.8,24 17.8,23 13,23 10.6,25.4 10.6,28.99 SV3.6
N$6
  Top 0.15: 23.14,34.86 U$1.45
  Top 0.254: 23.14,34.86 22.4,35.6 19.61,35.6 SV3.11
N$7
  Top 0.45: R13.1 R14.1 R15.1 | R16.1 R15.1 | X1.2 62.1,72.41 R15.1
N$8
  Top 0.45: R20.1 R19.1 R18.1 R17.1 57,69.59 X1.3
N$9
  Top 0.45: R9.1 78.45,70.8 76.4,70.8 74.95,69.35 R10.1 R11.1 R12.1 66.59,72.46 X1.1
N$10
  Top 0.254: U$1.62 38.74,29.46 39.6,28.6 43,28.6 51.4,37 52.6,37 54,38.4 54,48.2 44.27,57.93 SV2.3
N$11
  Top 0.254: U$1.63 39.24,30.16 39.6,29.8 42.6,29.8 51.1,38.3 51.9,38.3 52.8,39.2 52.8,47.8 41.73,58.87 SV2.1
N$12
  Top 0.15: 35.24,25.64 U$1.55
  Top 0.254: 35.24,25.64 32.4,22.8 19.4,22.8 18.4,21.8 12.4,21.8 9.4,24.8 9.4,30.33 SV3.8
N$13
  Top 0.15: 35.74,24.54 U$1.56
  Top 0.254: 35.74,24.54 32.8,21.6 20.2,21.6 19.2,20.6 11.8,20.6 8.2,24.2 8.2,31.67 SV3.10
N$14
  Top 0.15: 27.86,34.36 U$1.46
  Top 0.254: SV3.9 18.07,34.6 22,34.6 22.5,34.1 27.6,34.1 27.86,34.36
N$15
  Top 0.254: U$1.19 38.74,58.86 34.8,62.8 32.4,62.8 30.36,64.84 FX1.9
N$16
  Top 0.45: X1.13 58.41,79 45.9,79 41.8,74.9 R25.1
N$17
  Top 0.15: 29.06,33.86 U$1.47
  Top 0.254: 29.06,33.86 28.4,33.2 16.93,33.2 SV3.7
N$18
  Top 0.45: R24.1 46.45,71.5 50,71.5 54.7,76.2 56.24,76.2 X1.14
N$19
  Top 0.45: SV2.6 46.9,64.8 R20.2
N$20
  Top 0.2: U$1.22 U$1.21 37.74,41.46
  Top 0.45: 37.74,41.46 38,41.2 40.2,41.2 43.6,44.6 43.6,48.35 | 43.6,48.35 L1.1 | 43.6,48.35 45.77,48.35 U$2.P$1
N$21
  Top 0.15: U$1.36 29.44,39.36 28.8,40
  Top 0.254: 28.8,40 28.8,42.28 LED3.C
N$22
  Top 0.15: U$1.37 29.11,38.86 28.54,38.86
  Top 0.254: 28.54,38.86 25.33,42.07 LED2.C
N$23
  Top 0.15: 26.5,38.36 U$1.38
  Top 0.254: LED1.C 26.5,38.36
N$24
  Top 0.15: U$1.48 29.76,33.36 28.4,32
  Top 0.254: 28.4,32 16.15,32 SV3.5
N$25
  Top 0.45: LED2.A R3.2
N$26
  Top 0.45: LED1.A 22.22,48.34 R2.2
N$27
  Top 0.45: FX1.2 20.82,54.42 20.6,54.2 16.8,54.2 15.3,55.7 13.41,55.7 C2.1
N$28
  Top 0.45: FX1.3 22.09,57.1 21.7,57.5 18.8,57.5 13.82,62.48 X2.2
N$29
  Top 0.45: FX1.6 25.91,57.7 24.8,58.8 19.8,58.8 15.1,63.51 X2.3
N$30
  Top 0.45: FX1.10 27.18,65.78 27.8,66.4 33,66.4 40.1,59.3 40.1,58.2 40.63,57.67 C5.1 41.85,56.65 43.46,55.04 L1.2
N$31
  Top 0.254: U$1.24 36.24,43.76 35.6,44.4 32.8,44.4 32.4,44.8 32.4,46.74 C7.1
N$32
  Top 0.254: U$1.23 36.74,44.85 C8.1
N$33
  Top 0.254: U$1.17 40.26,42.86 41.7,44.3 41.7,45.57 R5.2
N$34
  Top 0.45: C7.2 32.27,50.95 R7.2 31.64,51.16 30,52.8 30,59.6 28.4,61.2 21.2,61.2 19.6,62.8 19.6,64.8 FX1.16
N$35
  Top 0.45: C8.2 34.67,50.87 R6.2 35.93,51.13 36.8,52 36.8,57.2 34.8,59.2 32,59.2 28.8,62.4 23.2,62.4 22.09,63.51 FX1.14
N$36
  Top 0.45: C6.1 34.63,53.33 R6.1 34.9,53.06 R7.1
N$37
  Top 0.254: U$1.20 38.24,44.16 37.6,44.8 37.6,58 34.8,60.8 32.4,60.8 30,63.2 26.4,63.2 26,63.6 26,64.75 FX1.11
N$38
  Top 0.45: FX1.8 28.45,59.05 27.5,60 20.6,60 18.1,62.5 18.1,66.4 18.91,67.2 X2.6
N$39
  Top 0.45: SV2.8 49.4,64.76 R19.2
N$40
  Top 0.45: SV2.10 R18.2
N$41
  Top 0.45: SV2.14 57,64.74 R17.2
N$42
  Top 0.45: SV2.16 R16.2
N$43
  Top 0.45: SV2.18 62.1,64.76 R15.2
N$44
  Top 0.45: SV2.20 R14.2
N$45
  Top 0.45: SV2.22 67.1,64.74 R13.2
N$46
  Top 0.45: SV2.24 69.7,64.74 R12.2
N$47
  Top 0.45: SV2.26 72.3,64.8 R11.2
N$48
  Top 0.45: SV2.28 74.8,64.76 R10.2
N$49
  Top 0.45: SV2.32 79.9,64.78 R9.2
N$50
  Top 0.45: SV2.4 44.3,64.74 R24.2
N$51
  Top 0.45: SV2.2 41.8,64.78 R25.2
N$52
  Top 0.254: U$1.49 29.36,31.36 29,31 17.69,31 SV3.3
N$53
  Top 0.15: 33.74,28.94 U$1.52
  Top 0.254: 33.74,28.94 31.2,26.4 17.8,26.4 16.6,25.2 14.77,25.2 SV3.2
N$54
  Top 0.15: 34.24,27.84 U$1.53
  Top 0.254: 34.24,27.84 31.6,25.2 18.2,25.2 17.2,24.2 13.6,24.2 11.8,26 11.8,27.65 SV3.4
N$55
  Top 0.15: 28.66,35.86 U$1.43
  Top 0.254: 28.66,35.86 28.4,35.6 23.6,35.6 21.6,37.6 20.15,37.6 SV3.13
N$56
  Top 0.15: 24.44,36.36 U$1.42
  Top 0.254: 24.44,36.36 21.2,39.6 20,39.6 18.2,41.4 18.2,42.09 SV3.15
N$57
  Top 0.15: 36.24,23.04 U$1.57
  Top 0.254: 36.24,23.04 33.2,20 20.6,20 20,19.4 11.2,19.4 7,23.6 7,33.01 SV3.12
N$58
  Top 0.15: 36.74,21.54 U$1.58
  Top 0.254: 36.74,21.54 33.6,18.4 20.8,18.4 20.6,18.2 10.4,18.2 5.8,22.8 5.8,34.35 SV3.14
N$59
  Top 0.15: 37.24,20.04 U$1.59
  Top 0.254: 37.24,20.04 34,16.8 9.8,16.8 4.6,22 4.6,35.69 SV3.16
N$60
  Top 0.15: 37.74,18.54 U$1.60
  Top 0.254: 37.74,18.54 34.8,15.6 9,15.6 3.4,21.2 3.4,39.2 12.6,48.4 14.43,48.4 SV3.17
N$61
  Top 0.45: R8.2 26.9,76.4 26.2,75.7 18.2,75.7 16.36,73.86 X2.4
N$62
  Top 0.45: R21.2 19.79,74 X2.5
N$63
  Top 0.45: R22.2 26.8,71.6 26.55,71.85 X2.7
N$64
  Top 0.45: R23.2 26.45,67 23.75,67 X2.8
N$65
  Top 0.45: R21.1 R8.1 32.95,76.4 R26.2
N$66
  Top 0.45: X3.1 38.2,7.6 43.2,7.6 | 43.2,7.6 R32.1 | R28.2 45.05,7.6 43.2,7.6
N$67
  Top 0.45: R22.1 R23.1 32.95,69.2 R27.2
N$68
  Top 0.45: R33.1 26.85,5.4 X3.5 31.4,9.1 33.1,10.8 48.55,10.8 R29.2
N$69
  Top 0.45: R26.1 R27.1 35.7,71.35 C1.1
N$70  (2 unrouted)
  Top 0.45: 9.17,56.04 C2.2 | 9.15,69.16 X2.S3
  Top 1.27: C1.2 36.8,78.1 33.65,81.25 X2.S2 18.15,81.25 8.87,71.97 X2.S3 | C3.2 9.17,56.04 | C2.2 9.15,69.16
N$71
  Top 0.45: X4.1 19,8 19.6,8 21.2,9.6 24,9.6 | 24,9.6 26.8,12.4 48,12.4 49.2,13.6 R30.2 | 24,9.6 R34.1
N$72
  Top 0.45: R31.2 26.65,14.25 23.6,11.2 17.6,11.2 17.1,11.7 13.9,11.7 12.2,10 X4.5 7.65,5.8 R35.1
N$73
  Top 0.45: R36.2 62.2,5.9 63.34,4.76 IC2.12
N$74
  Top 0.45: IC2.1 53.2,9.85 C4.1
N$75
  Top 0.45: IC2.3 53.45,7.3 C4.2
N$76
  Top 0.45: IC2.4 51.19,6.04 C9.1
N$77
  Top 0.45: IC2.5 52.97,4.76 52.1,3.9 50.95,3.9 C9.2
N$78
  Top 0.45: IC2.2 57.27,8.57 58,9.3 58,11.75 C10.1
N$79
  Top 0.45: IC2.6 53.8,3.5 52.1,1.8 49.2,1.8 48.5,2.5 48.5,3.75 C11.1
N$80
  Top 0.45: IC2.14 67.3,7.3 68.2,6.4 68.2,3.2 69.9,1.5 73.6,1.5 73.9,1.8 89,1.8 91.7,4.5 91.7,6.9 90.5,8.1 88.4,8.1 87.04,6.74 X7.2
N$81  (1 unrouted)
  Top 0.45: IC2.13 66.36,6.04 67.2,5.2 67.2,2.2 68.9,0.5 82.5,0.5 82.6,0.4 89.6,0.4 93.1,3.9 93.1,7.8 91.5,9.4 87.33,9.4 X7.3
N$82
  Top 0.45: U$4.P$8 66.64,12.16 64.59,14.21 SV1.22
N$83
  Top 0.45: U$4.P$7 67.36,13.44 66.4,14.4 66.4,18.2 SV1.20
N$84
  Top 0.45: U$4.P$6 68.2,17.46 SV1.18
N$85
  Top 0.45: U$4.P$2 80.89,10.89 82.4,12.4 82.4,16.36 SV1.10
N$86
  Top 0.45: U$4.P$4 79.03,13.44 79.4,13.8 79.4,15.8 79,16.2 74.94,16.2 SV1.16
N$87
  Top 0.45: U$4.P$3 79.77,12.16 80.9,13.3 80.9,16.1 79.6,17.4 76.28,17.4 SV1.14
N$88
  Top 0.45: R37.2 94,34.45 94,38.6 95.45,40.05 | R40.2 97.35,41.95 95.45,40.05 | X6.2 91,44.5 95.45,40.05
N$89
  Top 0.45: R38.2 93,32.2 91.9,33.3 91.9,40.7 90.1,42.5 X6.3 84.45,42.5 R39.2
N$90
  Top 0.254: U$5.10 96.55,27.15 97.2,27.8 97.2,34.1 96.9,34.4 R37.1
N$91
  Top 0.254: R38.1 95.95,28.35 95.4,27.8 U$5.11
N$92
  Top 0.254: SV1.1 90.2,21.68 90.2,27.4 89.8,27.8 U$5.4
N$93
  Top 0.254: SV1.3 87.45,22.35 86,23.8 86,26 87.15,27.15 U$5.5
N$94
  Top 0.254: U$5.2 89.9,29.1 91,28 91,22.8 91.4,22.4 91.4,20.34 SV1.2
N$95
  Top 0.254: U$5.13 92.5,29.1 92,28.6 92,23.2 92.4,22.8 92.4,19 90.8,17.4 88.98,17.4 SV1.4
N$96
  Top 0.254: U$5.12 93.45,28.45 93,28 93,24.4 93.6,23.8 93.6,18.4 91.4,16.2 87.64,16.2 SV1.6
N$97
  Top 0.254: U$5.9 95.5,26.5 96,26 96,18.8 92.2,15 86.3,15 SV1.8
RAS_18
  Top 0.254: IC1.18 68.27,54.67 69.67,56.07 SV2.23
REFCLK
  Top 0.254: U$1.1 44.56,33.36 48.8,37.6 48.8,39.35 QG1.3
UART_RX
  Top 0.45: R36.1 62.2,18.78 SV1.24
UART_TX
  Top 0.45: IC2.11 62.3,3.5 60.6,5.2 60.6,12.5 59.51,13.59 SV1.26
VCC  (via drill 0.61)  (3 unrouted)
  Top 0.2: 32.4,28.8 33.24,29.64 U$1.51 33.24,35.96 | 31.84,37.36 U$1.40 25.84,37.36 | 34.14,36.86 U$1.8 42.76,36.86
  Top 0.254: U$5.14 U$5.1 88.68,31.57 C12.1 | 67.8,10.89 U$4.P$9 | IC2.16 65.26,9.9 | 61.03,47.7 IC1.27 | v83.8,46.1 83.77,46.07 | 26.5,29.15 C14.1 | v90.8,32.1 90.75,32.05 | 42.76,36.86 43.2,37.3 R1.1 46.11,37.31 47.6,38.8 47.6,41.4 49.7,43.5 QG1.4 49.48,45.57 U$2.P$3 | 86.25,11.5 C15.1
  Top 0.45: 32.4,28.8 31.2,27.6 26.5,27.6 | R4.1 25.38,50.23 R3.1 25.28,50.33 R2.1 20.73,50.33 19.6,49.2 19.6,41.6 20.4,40.8 22,40.8 25.44,37.36 25.84,37.36 | 31.84,37.36 33.24,35.96 34.14,36.86 | 26.5,27.6 16.83,27.6 SV3.1 | 67.8,10.89 66.8,9.9 65.26,9.9 | v58.5,47.7 61.03,47.7 | 80.27,46.23 IC1.3 | 80.27,46.23 80.8,45.7 81.5,45.7 81.87,46.07 | IC1.9 75.47,45.73 75.8,45.4 79.44,45.4 80.27,46.23 | 83.77,46.07 81.87,46.07 | 81.87,46.07 IC1.1 | IC1.14 71.47,45.47 71.2,45.2 | IC1.43 73.07,39 77.3,39 77.87,38.43 IC1.49 | 26.5,27.6 26.5,29.15 | v64.1,12 65.2,10.9 IC2.16
  Top 0.813: SV2.29 77.29,60.69 v76.2,59.6 | 73.07,39 73.07,43.33 71.2,45.2 58.8,45.2 | 58.8,45.2 C13.1 | 58.8,45.2 58.5,45.5 v58.5,47.7 | 90.75,32.05 C12.1 | C10.2 56.25,13.25 v57.3,14.3 | v90.6,11.5 86.25,11.5
  Bottom 0.813: 74.6,58 v76.2,59.6 | 74.6,58 62.2,58 58.5,54.3 v58.5,47.7 | 83.8,48.8 v83.8,46.1 | 83.8,48.8 74.6,58 | v57.3,14.3 59.6,12 v64.1,12 90.1,11.9 v90.6,11.5 93.2,11.5 96.9,15.2 96.9,26 v90.8,32.1 93,34.3 93,51.3 91,53.3 88.3,53.3 83.8,48.8
VCC_5  (via drill 0.61)
  Top 0.45: 19,3 X4.4 19.25,3.05 | 38.2,2.6 X3.4
  Top 0.813: 19,3 17.2,1.2 9.45,1.2 R35.2 4.65,3.45 3.9,4.2 v3.9,9.6 | 19.25,3.05 R34.2 R33.2 28.25,1.2 36.8,1.2 38.2,2.6 | R32.2 42.65,2.9 X3.4 | v76.7,28.7 76.7,25 77.29,24.41 SV1.11 | v90.4,47 X6.1
  Bottom 0.813: v3.9,9.6 3.9,16.1 10.7,22.9 17.7,22.9 22.2,27.4 49.5,27.4 50.8,28.7 v76.7,28.7 76.7,35.3 79,37.6 87.8,37.6 88.6,38.4 88.9,38.4 89.2,38.7 89.7,38.7 90.4,39.4 v90.4,47
WE_16
  Top 0.254: IC1.16 69.87,52.67 74.75,57.55 SV2.27